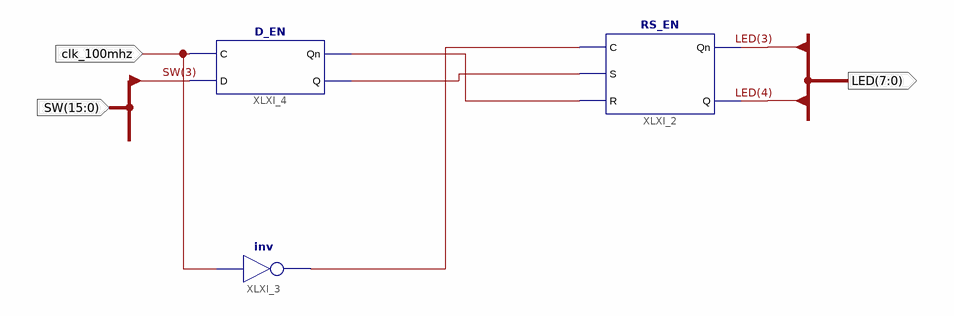
[diagram p0: schematic sheet 1]
// Xilinx ISE schematic D_Trig.sch (kintex7) as structural Verilog: 3 symbols, 3 ports
module D_Trig (
  input  clk_100mhz,
  input  [15:0] SW,
  output [7:0] LED
);

  wire XLXN_3, XLXN_4, XLXN_5;

  RS_EN XLXI_2 (.C(XLXN_5), .S(XLXN_4), .R(XLXN_3), .Qn(LED[3]), .Q(LED[4]));
  not XLXI_3 (XLXN_5, clk_100mhz);
  D_EN XLXI_4 (.C(clk_100mhz), .D(SW[3]), .Qn(XLXN_3), .Q(XLXN_4));
endmodule
